# EAGLE design light_sensors (EAGLE 9.6.2)
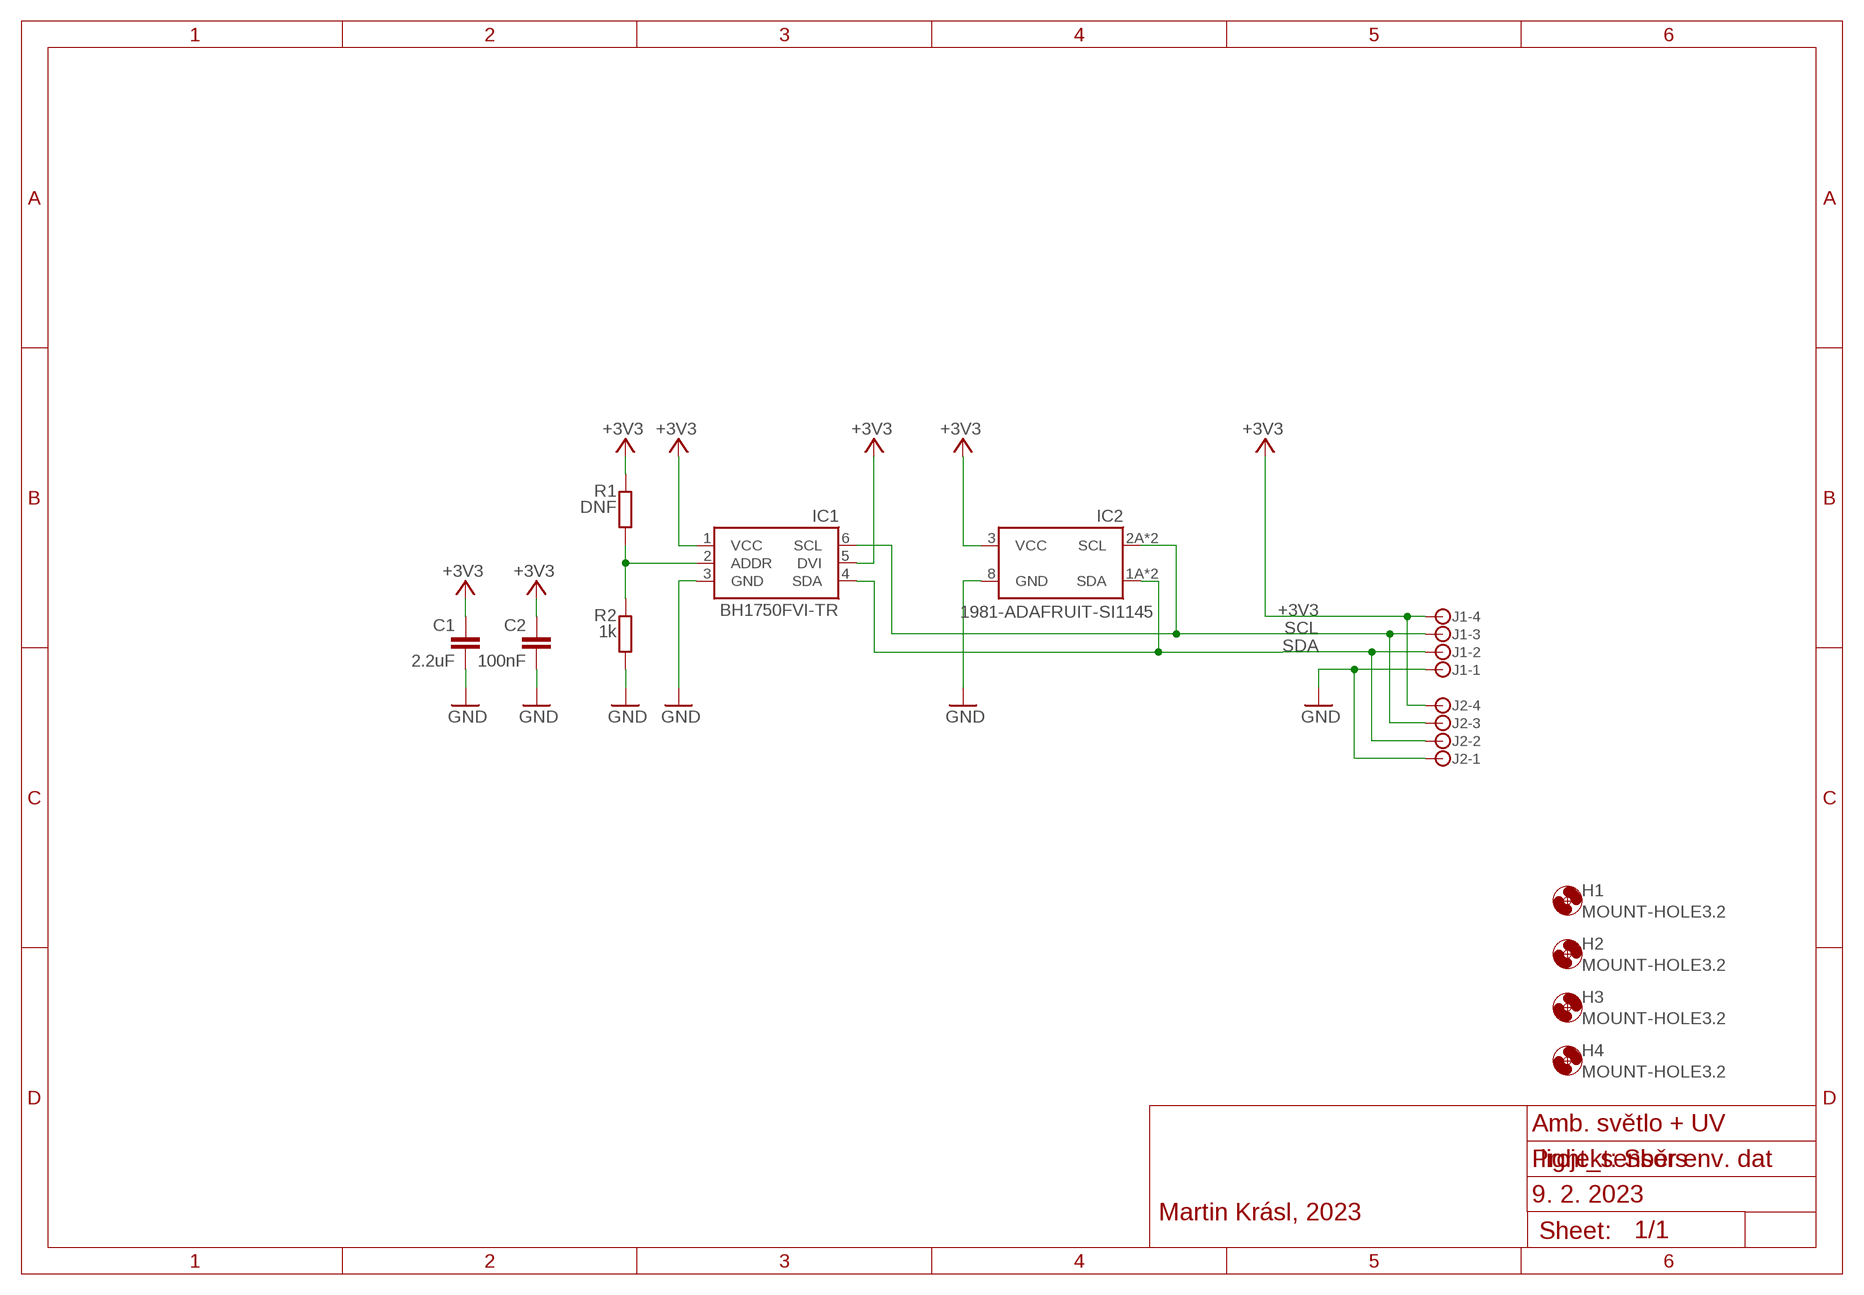
[diagram p0: schematic, sheet 1]

## Parts
C1  2.2uF  C-EUC0805  [C0805]
C2  100nF  C-EUC0402  [C0402]
H1  MOUNT-HOLE3.2  [3,2]
H2  MOUNT-HOLE3.2  [3,2]
H3  MOUNT-HOLE3.2  [3,2]
H4  MOUNT-HOLE3.2  [3,2]
IC1  BH1750FVI-TR  [WSOF6]
IC2  1981-ADAFRUIT-SI1145  [1981-ADAFRUIT-SI1145]
J1  JST-XH-4  [B4B-XH-A]
J2  JST-XH-4  [B4B-XH-A]
R1  DNF  R-EU_R0402  [R0402]
R2  1k  R-EU_R0402  [R0402]

## Nets
+3V3: C1.1 C2.1 IC1.1(VCC) IC1.5(DVI) IC2.3(VCC) J1.4 J2.4 R1.2
GND: C1.2 C2.2 IC1.3(GND) IC2.8(GND) J1.1 J2.1 R2.1
N$1: IC1.2(ADDR) R1.1 R2.2
SCL: IC1.6(SCL) IC2.2A(SCL) IC2.2B(SCL) J1.3 J2.3
SDA: IC1.4(SDA) IC2.1A(SDA) IC2.1B(SDA) J1.2 J2.2

## Notes on the sheet
- Amb. světlo + UV
- Projekt: Sběr env. dat
- 9. 2. 2023
- Martin Krásl, 2023

## Library data of the parts
C1 C2 = rcl:C-EU: CAPACITOR, European symbol; SPICEPREFIX: C
H1-H4 = holes:MOUNT-HOLE: MOUNTING HOLE with drill center marker
IC1 = BH1750FVI-TR:BH1750FVI-TR: Ambient Light Sensor,16bit,I2C,WSOF6I ROHM BH1750FVI-TR Ambient Light Sensor Unit Surface Mount Source: Datasheet <https://componentsearchengine.com/Datasheets/2/BH1750FVI-TR.pdf>; ARROW_PART_NUMBER: BH1750FVI-TR; ARROW_PRICE-STOCK: https://www.arrow.com/en/products/bh1750fvi-tr/rohm-semiconductor; DESCRIPTION: Ambient Light Sensor,16bit,I2C,WSOF6I ROHM BH1750FVI-TR Ambient Light Sensor Unit Surface Mount; HEIGHT: mm; MANUFACTURER_NAME: ROHM Semiconductor; MANUFACTURER_PART_NUMBER: BH1750FVI-TR; MOUSER_PART_NUMBER: 755-BH1750FVI-TR; MOUSER_PRICE-STOCK: https://www.mouser.co.uk/ProductDetail/ROHM-Semiconductor/BH1750FVI-TR?qs=phc6PQ%252BTPUNy88lRCs6mVA%3D%3D
IC2 = 1981-Adafruit-Si1145:1981-ADAFRUIT-SI1145: Ambient Light Sensor,16bit,I2C,WSOF6I ROHM BH1750FVI-TR Ambient Light Sensor Unit Surface Mount Source: Datasheet <https://componentsearchengine.com/Datasheets/2/BH1750FVI-TR.pdf>; ARROW_PART_NUMBER: BH1750FVI-TR; ARROW_PRICE-STOCK: https://www.arrow.com/en/products/bh1750fvi-tr/rohm-semiconductor; DESCRIPTION: Ambient Light Sensor,16bit,I2C,WSOF6I ROHM BH1750FVI-TR Ambient Light Sensor Unit Surface Mount; HEIGHT: mm; MANUFACTURER_NAME: ROHM Semiconductor; MANUFACTURER_PART_NUMBER: BH1750FVI-TR; MOUSER_PART_NUMBER: 755-BH1750FVI-TR; MOUSER_PRICE-STOCK: https://www.mouser.co.uk/ProductDetail/ROHM-Semiconductor/BH1750FVI-TR?qs=phc6PQ%252BTPUNy88lRCs6mVA%3D%3D
J1 J2 = con-JST-XH:JST-XH-4: JST-XH 4-way vertical TH; MF: JST; MPN: B4B-XH-A
R1 R2 = rcl:R-EU_: RESISTOR, European symbol; SPICEPREFIX: R

## Net classes
0 default: width 0.152 mm, clearance 0.152 mm

## Board
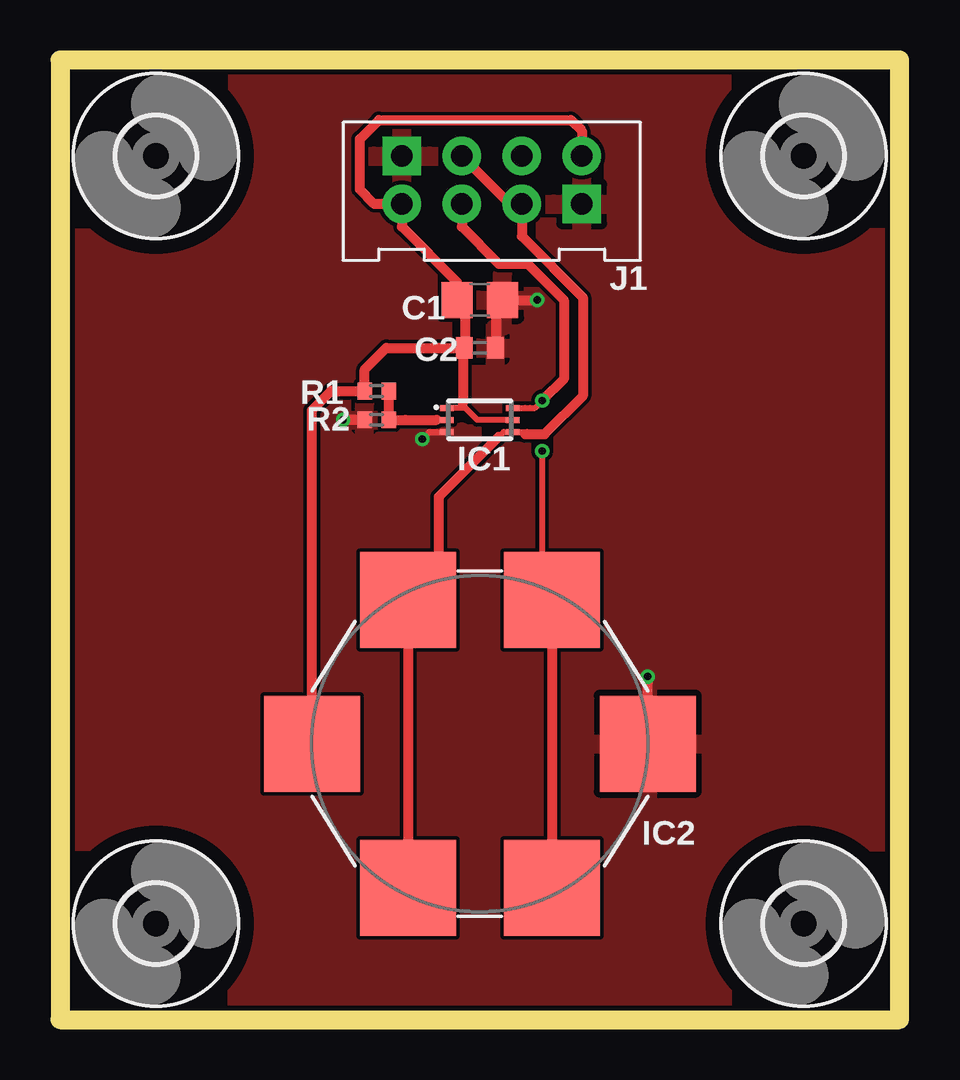
[diagram p1: board, top side]
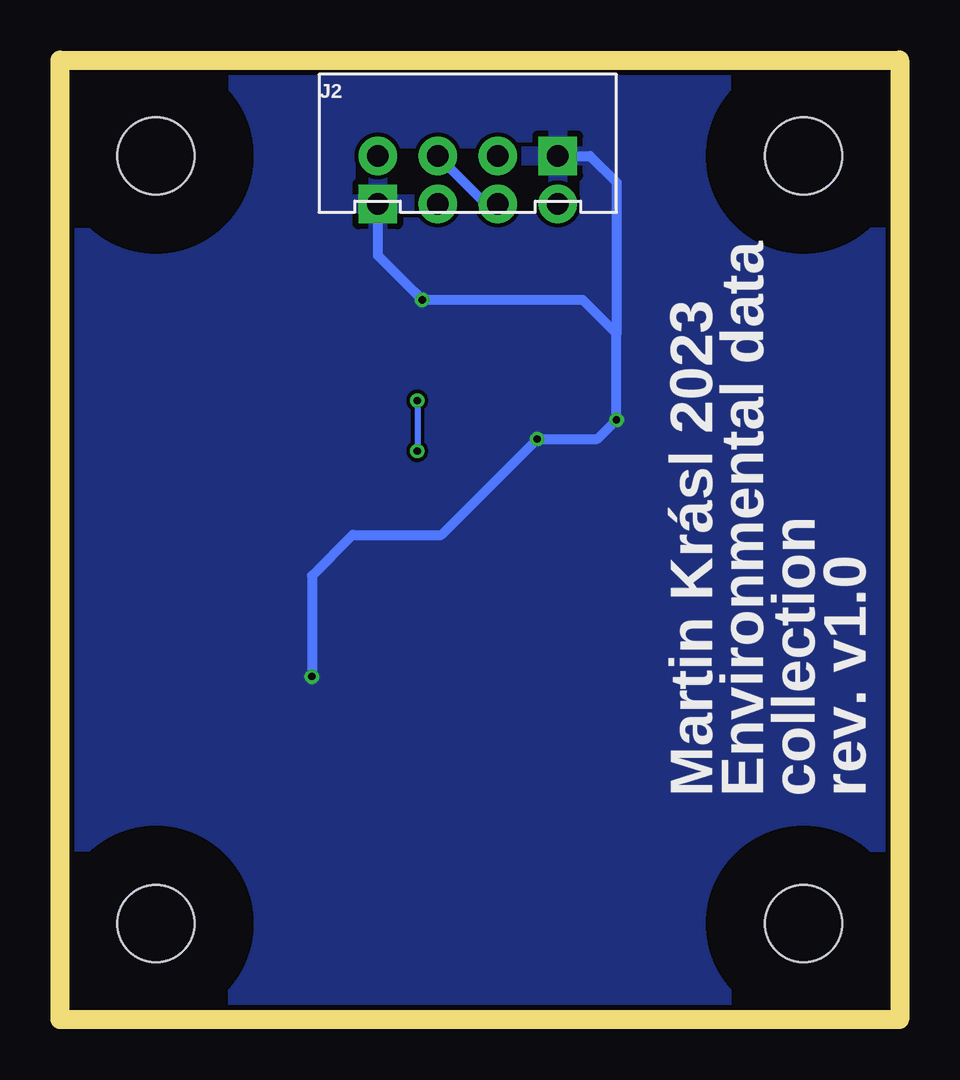
[diagram p2: board, bottom side, seen from below]

Size 35 x 40 mm. Coordinates in mm from the lower left corner, seen from the top.
Outline: 0,0 35,0 35,40 0,40 0,0
Copper layers (1*16): Top 0.035mm / dielectric 1.6mm / Bottom 0.035mm
Design rules "custom-jlcpcb": minimum track width 5mil, minimum drill 0.3mm, track to track 5mil, track to pad 5mil, pad to pad 5mil, via to via 5mil, smd to smd 0mil, copper to edge 0.2mm, drill to drill 6mil, minimum pad ring 10mil, minimum via ring 3mil, stop-mask expansion 4mil, vias tented up to drill 0.4mm, thermal gap 10mil

### Footprints (pad centres in the part's own frame; a part is rotated, then mirrored left to right if it is on the bottom)
C0805 = smd 1.3 x 1.5: 1 -0.95,0; 2 0.95,0
C0402 = smd 0.7 x 0.9: 1 -0.65,0; 2 0.65,0
3,2 = hole 3.2: 0,0
WSOF6 = smd 0.55 x 0.25: 1 -1.375,0.5; 2 -1.375,0; 3 -1.375,-0.5; 4 1.375,-0.5; 5 1.375,0; 6 1.375,0.5
1981-ADAFRUIT-SI1145 = smd 4 x 4: 1A -3,6; 1B -3,-6; 2A 3,6; 2B 3,-6; 3 -7,0; 8 7,0
B4B-XH-A = drill 0.9 square: 1 3.75,0 | drill 0.9: 2 1.25,0; 3 -1.25,0; 4 -3.75,0
R0402 = smd 0.6 x 0.7: 1 -0.5,0; 2 0.5,0

### Placement (x,y rotation side)
C1  17.5,30 0 top
C2  17.5,28 0 top
H1  4,36 0 top
H2  4,4 0 top
H3  31,4 0 top
H4  31,36 0 top
IC1  17.5,25 0 top
IC2  17.5,11.5 0 top
J1  18,34 0 top
J2  18,36 0 bottom
R1  13.2,26.2 180 top
R2  13.2,25 0 top

### Tracks (layer width: path | path; a pad name or v marks a point on that pad's centre or on a via)
+3V3
  Top 0.203: IC1.1 16.9,25.5 17.4,25
  Top 0.254: IC1.1 16.8,25.5 16.8,25.7 16.8,25.6 17.4,25 IC1.5
  Top 0.406: 16.8,28 15.8,28 13.6,28 12.7,27.1 R1.2 11.3,26.2 10.5,25.4 IC2.3 | 16.8,28 C2.1 16.9,28.05 16.9,29.65 C1.1 16.55,30.75 14.25,33.05 J1.4 13.1,34 12.5,34.6 12.5,36.7 13.3,37.5 21.3,37.5 21.75,37.05 J2.4 | 16.8,28 16.8,25.7
GND  (via drill 0.3 pad 0.6)
  Top 0.254: v15.1,24.2 15.4,24.5 IC1.3
  Top 0.406: R2.1 v11.8,25 | v19.9,30 C1.2 18.2,29.75 18.2,28.05 C2.2 | IC2.8 v24.5,14.3
  Bottom 0.406: 11.8,28.6 v11.8,25 12.6,24.2 v15.1,24.2 19.1,20.2 22.8,20.2 24.5,18.5 v24.5,14.3 | v19.9,30 18.5,30 13.2,30 11.8,28.6 | v19.9,30 20.25,30.35 | 20.25,30.35 21.75,31.85 J1.1 | v19.9,30 20.25,30.35 | J2.1 12.9,36 11.8,34.9 11.8,28.6
  pour Top: 0,40 35,40 35,0 0,0
  pour Bottom: 0,40 35,40 35,0 0,0
N$1
  Top 0.203: IC1.2 15.7,25
  Top 0.406: 15.7,25 14.4,25 R2.2 R1.1
SCL  (via drill 0.3 pad 0.6)
  Top 0.203: 19.4,25.5 19.6,25.5
  Top 0.254: v20.1,23.7 20.1,17.3 20.4,17 20.5,17.1 IC2.2A | IC1.6 19.4,25.5 19.6,25.5 19.8,25.5 v20.1,25.8
  Top 0.406: v20.1,25.8 21,26.7 21,30 19.5,31.5 18.3,31.5 16.75,33.05 J1.3 | IC2.2A IC2.2B
  Bottom 0.254: v20.1,25.8 v20.1,23.7
  Bottom 0.406: J2.3 17.25,34 J1.3
SDA
  Top 0.254: 18.3,24.3 18.5,24.5 IC1.4 19.48,24.5 19.57,24.4 19.4,24.4
  Top 0.406: J2.2 18.75,34 J1.2 19.25,32.65 21.8,30.1 21.8,26 20.2,24.4 19.4,24.4 | 18.3,24.3 15.8,21.8 15.8,17.7 15.6,17.5 IC2.1A IC2.1B

### Text on the board
bPlace: Martin Krásl 2023 / Environmental data / collection / rev. v1.0